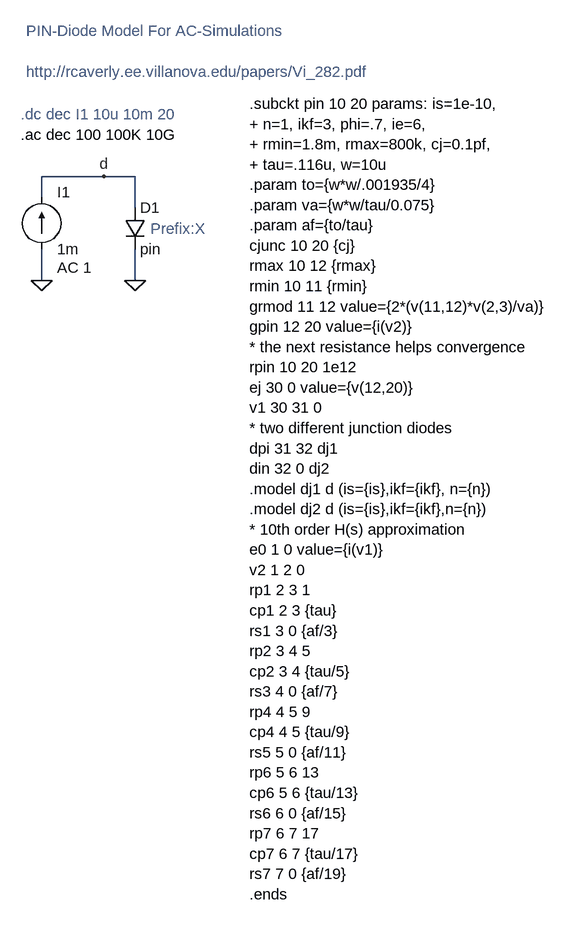
[diagram p0: schematic pin_diode_ac.asc]
pin_diode_ac.asc, the LTspice schematic file:
Version 4
SHEET 1 880 1164
WIRE -128 64 -224 64
WIRE -80 64 -128 64
WIRE -224 96 -224 64
WIRE -80 112 -80 64
WIRE -224 224 -224 176
WIRE -80 224 -80 176
FLAG -224 224 0
FLAG -80 224 0
FLAG -128 64 d
SYMBOL diode -96 112 R0
SYMATTR InstName D1
SYMATTR Value pin
SYMATTR Prefix X
SYMBOL current -224 176 M180
WINDOW 0 24 88 Left 0
WINDOW 3 24 0 Left 0
WINDOW 123 24 -28 Left 0
WINDOW 39 0 0 Left 0
SYMATTR InstName I1
SYMATTR Value 1m
SYMATTR Value2 AC 1
TEXT 96 -48 Left 0 !.subckt pin 10 20 params: is=1e-10,\n+ n=1, ikf=3, phi=.7, ie=6,\n+ rmin=1.8m, rmax=800k, cj=0.1pf,\n+ tau=.116u, w=10u\n.param to={w*w/.001935/4}\n.param va={w*w/tau/0.075}\n.param af={to/tau}\ncjunc 10 20 {cj}\nrmax 10 12 {rmax}\nrmin 10 11 {rmin}\ngrmod 11 12 value={2*(v(11,12)*v(2,3)/va)}\ngpin 12 20 value={i(v2)}\n* the next resistance helps convergence\nrpin 10 20 1e12\nej 30 0 value={v(12,20)}\nv1 30 31 0\n* two different junction diodes\ndpi 31 32 dj1\ndin 32 0 dj2\n.model dj1 d (is={is},ikf={ikf}, n={n})\n.model dj2 d (is={is},ikf={ikf},n={n})\n* 10th order H(s) approximation\ne0 1 0 value={i(v1)}\nv2 1 2 0\nrp1 2 3 1\ncp1 2 3 {tau}\nrs1 3 0 {af/3}\nrp2 3 4 5\ncp2 3 4 {tau/5}\nrs3 4 0 {af/7}\nrp4 4 5 9\ncp4 4 5 {tau/9}\nrs5 5 0 {af/11}\nrp6 5 6 13\ncp6 5 6 {tau/13}\nrs6 6 0 {af/15}\nrp7 6 7 17\ncp7 6 7 {tau/17}\nrs7 7 0 {af/19}\n.ends
TEXT -256 -32 Left 0 ;.dc dec I1 10u 10m 20
TEXT -256 0 Left 0 !.ac dec 100 100K 10G
TEXT -56 144 Left 0 ;Prefix:X
TEXT -248 -160 Left 0 ;PIN-Diode Model For AC-Simulations\n \nhttp://rcaverly.ee.villanova.edu/papers/Vi_282.pdf

The netlist it stands for:
* pin_diode_ac.asc
XD1 d 0 pin  ; pins + -
I1 0 d 1m AC 1
.subckt pin 10 20 params: is=1e-10,
+ n=1, ikf=3, phi=.7, ie=6,
+ rmin=1.8m, rmax=800k, cj=0.1pf,
+ tau=.116u, w=10u
.param to={w*w/.001935/4}
.param va={w*w/tau/0.075}
.param af={to/tau}
cjunc 10 20 {cj}
rmax 10 12 {rmax}
rmin 10 11 {rmin}
grmod 11 12 value={2*(v(11,12)*v(2,3)/va)}
gpin 12 20 value={i(v2)}
* the next resistance helps convergence
rpin 10 20 1e12
ej 30 0 value={v(12,20)}
v1 30 31 0
* two different junction diodes
dpi 31 32 dj1
din 32 0 dj2
.model dj1 d (is={is},ikf={ikf}, n={n})
.model dj2 d (is={is},ikf={ikf},n={n})
* 10th order H(s) approximation
e0 1 0 value={i(v1)}
v2 1 2 0
rp1 2 3 1
cp1 2 3 {tau}
rs1 3 0 {af/3}
rp2 3 4 5
cp2 3 4 {tau/5}
rs3 4 0 {af/7}
rp4 4 5 9
cp4 4 5 {tau/9}
rs5 5 0 {af/11}
rp6 5 6 13
cp6 5 6 {tau/13}
rs6 6 0 {af/15}
rp7 6 7 17
cp7 6 7 {tau/17}
rs7 7 0 {af/19}
.ends
* .dc dec I1 10u 10m 20
.ac dec 100 100K 10G
* Prefix:X
* PIN-Diode Model For AC-Simulations
* http://rcaverly.ee.villanova.edu/papers/Vi_282.pdf
.backanno
.end